# EAGLE design synthbadge (EAGLE 9.7.0)
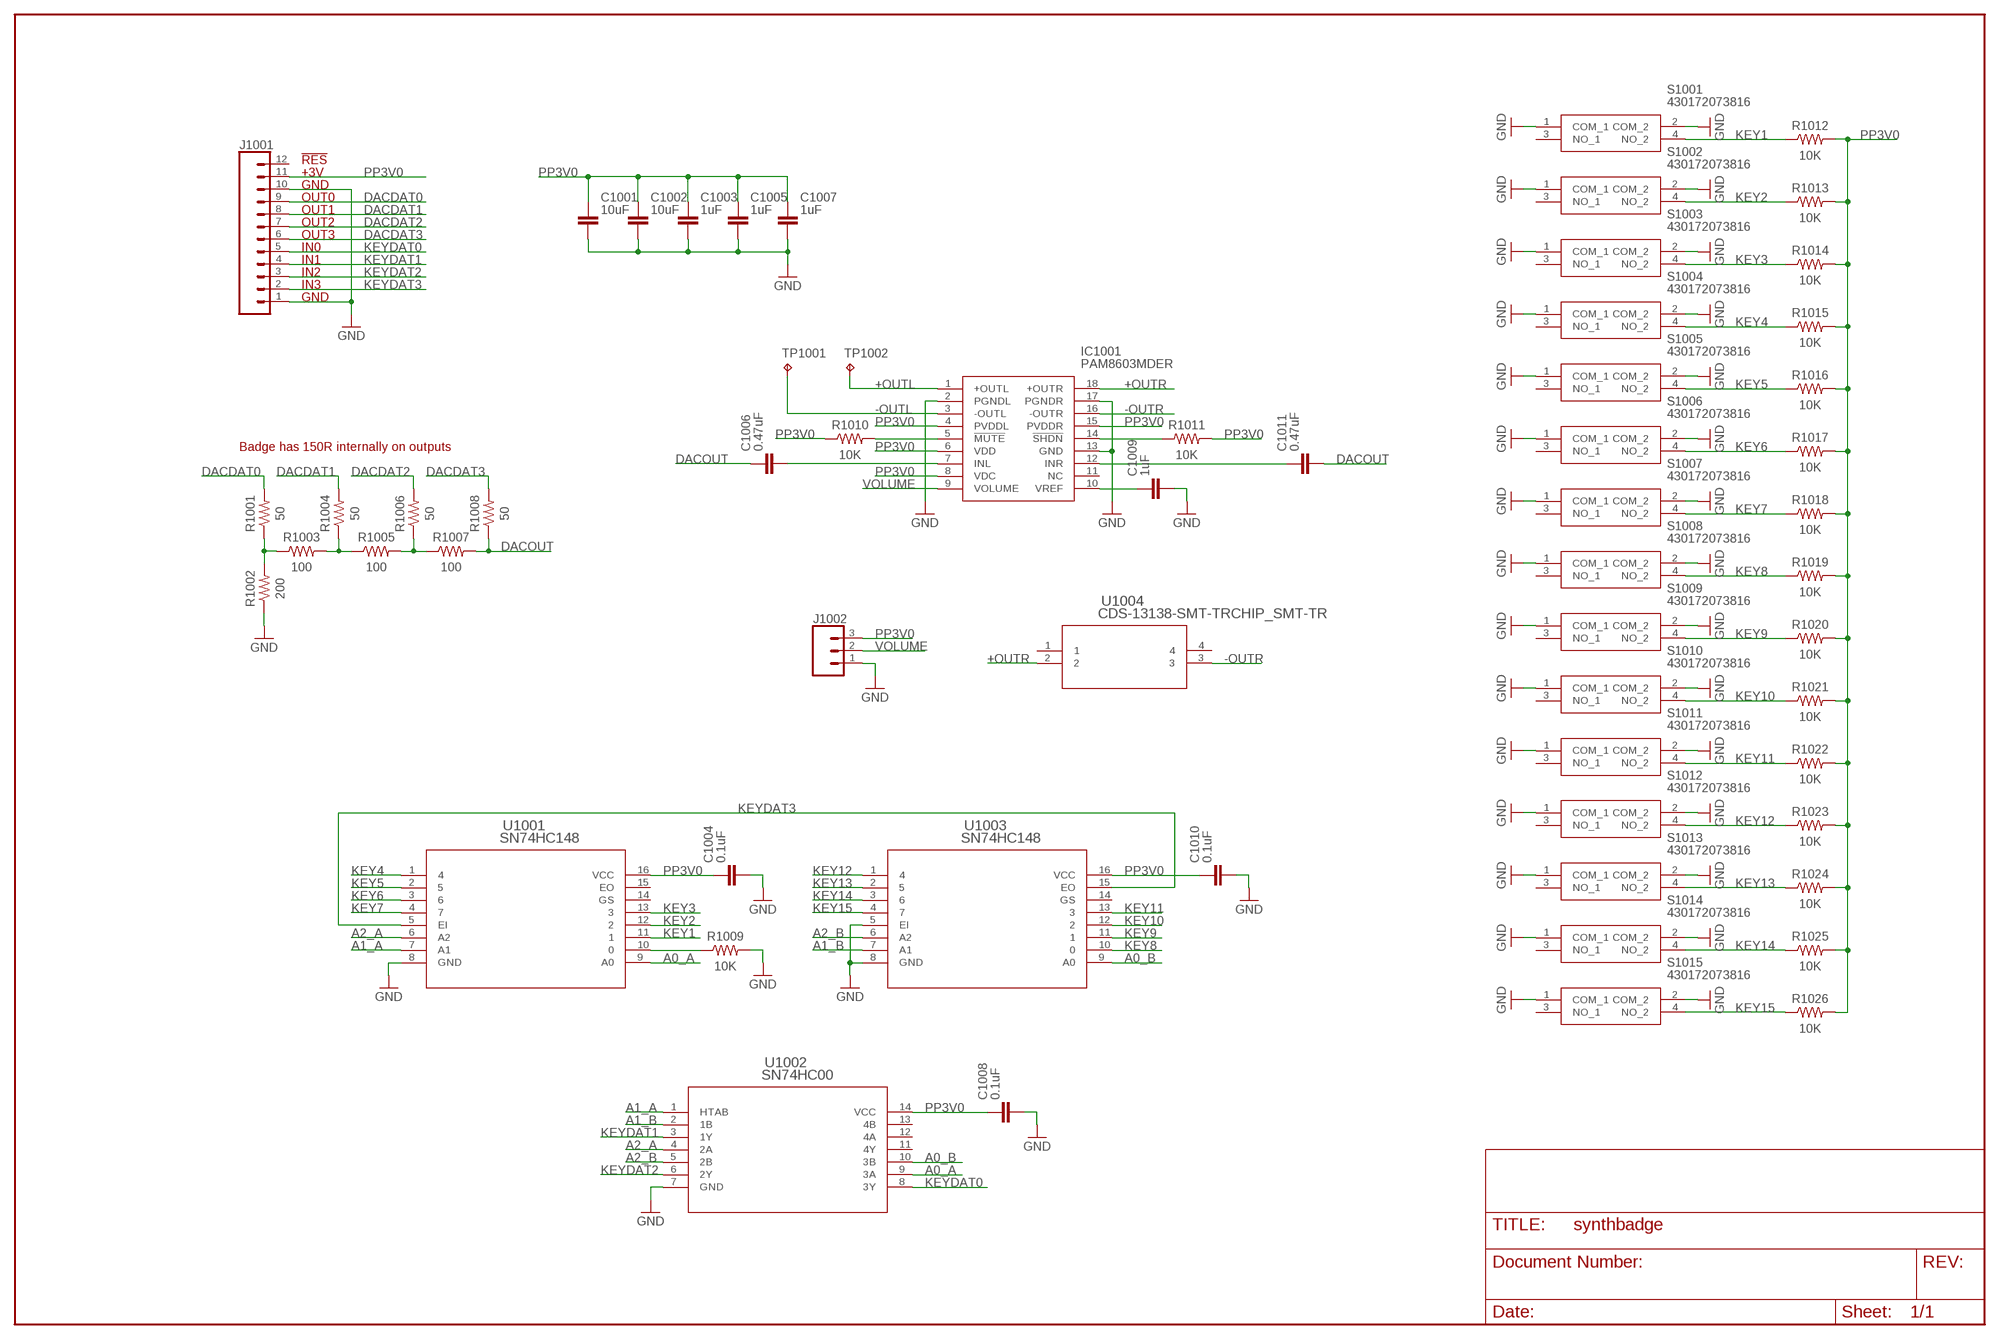
[diagram p0: schematic, sheet 1]

## Parts
C1001  10uF  C_CHIP-0805(2012-METRIC)  [CAPC2012X110]
C1002  10uF  C_CHIP-0805(2012-METRIC)  [CAPC2012X110]
C1003  1uF  C_CHIP-0805(2012-METRIC)  [CAPC2012X110]
C1004  0.1uF  C_CHIP-0805(2012-METRIC)  [CAPC2012X110]
C1005  1uF  C_CHIP-0805(2012-METRIC)  [CAPC2012X110]
C1006  0.47uF  C_CHIP-0805(2012-METRIC)  [CAPC2012X110]
C1007  1uF  C_CHIP-0805(2012-METRIC)  [CAPC2012X110]
C1008  0.1uF  C_CHIP-0805(2012-METRIC)  [CAPC2012X110]
C1009  1uF  C_CHIP-0805(2012-METRIC)  [CAPC2012X110]
C1010  0.1uF  C_CHIP-0805(2012-METRIC)  [CAPC2012X110]
C1011  0.47uF  C_CHIP-0805(2012-METRIC)  [CAPC2012X110]
IC1001  PAM8603MDER  [SOIC127P1032X270-18N]
J1001  CONN_12  [1X12]
J1002  CONN_03  [1X03]
R1001  50  R-US_CHIP-0805(2012-METRIC)  [RESC2012X65]
R1002  200  R-US_CHIP-0805(2012-METRIC)  [RESC2012X65]
R1003  100  R-US_CHIP-0805(2012-METRIC)  [RESC2012X65]
R1004  50  R-US_CHIP-0805(2012-METRIC)  [RESC2012X65]
R1005  100  R-US_CHIP-0805(2012-METRIC)  [RESC2012X65]
R1006  50  R-US_CHIP-0805(2012-METRIC)  [RESC2012X65]
R1007  100  R-US_CHIP-0805(2012-METRIC)  [RESC2012X65]
R1008  50  R-US_CHIP-0805(2012-METRIC)  [RESC2012X65]
R1009  10K  R-US_CHIP-0805(2012-METRIC)  [RESC2012X65]
R1010  10K  R-US_CHIP-0805(2012-METRIC)  [RESC2012X65]
R1011  10K  R-US_CHIP-0805(2012-METRIC)  [RESC2012X65]
R1012  10K  R-US_CHIP-0805(2012-METRIC)  [RESC2012X65]
R1013  10K  R-US_CHIP-0805(2012-METRIC)  [RESC2012X65]
R1014  10K  R-US_CHIP-0805(2012-METRIC)  [RESC2012X65]
R1015  10K  R-US_CHIP-0805(2012-METRIC)  [RESC2012X65]
R1016  10K  R-US_CHIP-0805(2012-METRIC)  [RESC2012X65]
R1017  10K  R-US_CHIP-0805(2012-METRIC)  [RESC2012X65]
R1018  10K  R-US_CHIP-0805(2012-METRIC)  [RESC2012X65]
R1019  10K  R-US_CHIP-0805(2012-METRIC)  [RESC2012X65]
R1020  10K  R-US_CHIP-0805(2012-METRIC)  [RESC2012X65]
R1021  10K  R-US_CHIP-0805(2012-METRIC)  [RESC2012X65]
R1022  10K  R-US_CHIP-0805(2012-METRIC)  [RESC2012X65]
R1023  10K  R-US_CHIP-0805(2012-METRIC)  [RESC2012X65]
R1024  10K  R-US_CHIP-0805(2012-METRIC)  [RESC2012X65]
R1025  10K  R-US_CHIP-0805(2012-METRIC)  [RESC2012X65]
R1026  10K  R-US_CHIP-0805(2012-METRIC)  [RESC2012X65]
S1001  430172073816  [430172073816]
S1002  430172073816  [430172073816]
S1003  430172073816  [430172073816]
S1004  430172073816  [430172073816]
S1005  430172073816  [430172073816]
S1006  430172073816  [430172073816]
S1007  430172073816  [430172073816]
S1008  430172073816  [430172073816]
S1009  430172073816  [430172073816]
S1010  430172073816  [430172073816]
S1011  430172073816  [430172073816]
S1012  430172073816  [430172073816]
S1013  430172073816  [430172073816]
S1014  430172073816  [430172073816]
S1015  430172073816  [430172073816]
TP1001  TPB2,54  [B2,54]
TP1002  TPB2,54  [B2,54]
U1001  SN74HC148  SN74HC148_D_16D16_TEX  [D16_TEX]
U1002  SN74HC00  SN74HC00_D_14D14_TEX  [D14_TEX]
U1003  SN74HC148  SN74HC148_D_16D16_TEX  [D16_TEX]
U1004  CDS-13138-SMT-TRCHIP_SMT-TR  [CHIP_SMT-TR]

## Nets
+OUTL: IC1001.1(+OUTL) TP1002.TP
+OUTR: IC1001.18(+OUTR) U1004.2
-OUTL: IC1001.3(-OUTL) TP1001.TP
-OUTR: IC1001.16(-OUTR) U1004.3
A0_A: U1001.9(A0) U1002.9(3A)
A0_B: U1002.10(3B) U1003.9(A0)
A1_A: U1001.7(A1) U1002.1(HTAB)
A1_B: U1002.2(1B) U1003.7(A1)
A2_A: U1001.6(A2) U1002.4(2A)
A2_B: U1002.5(2B) U1003.6(A2)
DACDAT0: J1001.9 R1001.2
DACDAT1: J1001.8 R1004.2
DACDAT2: J1001.7 R1006.2
DACDAT3: J1001.6 R1008.2
DACOUT: C1006.1 C1011.2 R1007.2 R1008.1
GND: C1001.2 C1002.2 C1003.2 C1004.2 C1005.2 C1007.2 C1008.2 C1009.2 C1010.2 IC1001.2(PGNDL) IC1001.13(GND) IC1001.17(PGNDR) J1001.1 J1001.10 J1002.1 R1002.1 R1009.2 S1001.1(COM_1) S1001.2(COM_2) S1002.1(COM_1) S1002.2(COM_2) S1003.1(COM_1) S1003.2(COM_2) S1004.1(COM_1) S1004.2(COM_2) S1005.1(COM_1) S1005.2(COM_2) S1006.1(COM_1) S1006.2(COM_2) S1007.1(COM_1) S1007.2(COM_2) S1008.1(COM_1) S1008.2(COM_2) S1009.1(COM_1) S1009.2(COM_2) S1010.1(COM_1) S1010.2(COM_2) S1011.1(COM_1) S1011.2(COM_2) S1012.1(COM_1) S1012.2(COM_2) S1013.1(COM_1) S1013.2(COM_2) S1014.1(COM_1) S1014.2(COM_2) S1015.1(COM_1) S1015.2(COM_2) U1001.8(GND) U1002.7(GND) U1003.5(EI) U1003.8(GND)
KEY1: R1012.1 S1001.4(NO_2) U1001.11
KEY2: R1013.1 S1002.4(NO_2) U1001.12
KEY3: R1014.1 S1003.4(NO_2) U1001.13
KEY4: R1015.1 S1004.4(NO_2) U1001.1
KEY5: R1016.1 S1005.4(NO_2) U1001.2
KEY6: R1017.1 S1006.4(NO_2) U1001.3
KEY7: R1018.1 S1007.4(NO_2) U1001.4
KEY8: R1019.1 S1008.4(NO_2) U1003.10
KEY9: R1020.1 S1009.4(NO_2) U1003.11
KEY10: R1021.1 S1010.4(NO_2) U1003.12
KEY11: R1022.1 S1011.4(NO_2) U1003.13
KEY12: R1023.1 S1012.4(NO_2) U1003.1
KEY13: R1024.1 S1013.4(NO_2) U1003.2
KEY14: R1025.1 S1014.4(NO_2) U1003.3
KEY15: R1026.1 S1015.4(NO_2) U1003.4
KEYDAT0: J1001.5 U1002.8(3Y)
KEYDAT1: J1001.4 U1002.3(1Y)
KEYDAT2: J1001.3 U1002.6(2Y)
KEYDAT3: J1001.2 U1001.5(EI) U1003.15(EO)
N$1: C1006.2 IC1001.7(INL)
N$2: C1011.1 IC1001.12(INR)
N$3: C1009.1 IC1001.10(VREF)
N$4: R1009.1 U1001.10
N$5: IC1001.14(!SHDN) R1011.1
N$6: IC1001.5(!MUTE) R1010.2
N$11: R1001.1 R1002.2 R1003.1
N$12: R1003.2 R1004.1 R1005.1
N$13: R1005.2 R1006.1 R1007.1
PP3V0: C1001.1 C1002.1 C1003.1 C1004.1 C1005.1 C1007.1 C1008.1 C1010.1 IC1001.4(PVDDL) IC1001.6(VDD) IC1001.8(VDC) IC1001.15(PVDDR) J1001.11 J1002.3 R1010.1 R1011.2 R1012.2 R1013.2 R1014.2 R1015.2 R1016.2 R1017.2 R1018.2 R1019.2 R1020.2 R1021.2 R1022.2 R1023.2 R1024.2 R1025.2 R1026.2 U1001.16(VCC) U1002.14(VCC) U1003.16(VCC)
VOLUME: IC1001.9(VOLUME) J1002.2
Unconnected: IC1001.11(NC) J1001.12 S1001.3(NO_1) S1002.3(NO_1) S1003.3(NO_1) S1004.3(NO_1) S1005.3(NO_1) S1006.3(NO_1) S1007.3(NO_1) S1008.3(NO_1) S1009.3(NO_1) S1010.3(NO_1) S1011.3(NO_1) S1012.3(NO_1) S1013.3(NO_1) S1014.3(NO_1) S1015.3(NO_1) U1001.14(GS) U1001.15(EO) U1002.11(4Y) U1002.12(4A) U1002.13(4B) U1003.14(GS) U1004.1 U1004.4

## Notes on the sheet
- !RES
- +3V
- GND
- OUT0
- OUT1
- OUT2
- OUT3
- IN0
- IN1
- IN2
- IN3
- GND
- Badge has 150R internally on outputs

## Library data of the parts
C1001-C1011 = rc_WAi:C: Capacitor - Generic; CATEGORY: Capacitor
IC1001 = PAM8603MDER:PAM8603MDER: Audio Amplifiers 3W STEREO FILTERLESS CLASS-D AUDIO AMP Source: Datasheet <https://datasheet.datasheetarchive.com/originals/distributors/Datasheets-DGA6/534093.pdf>; DESCRIPTION: Audio Amplifiers 3W STEREO FILTERLESS CLASS-D AUDIO AMP; HEIGHT: 2.7mm; MANUFACTURER_NAME: Diodes Inc.; MANUFACTURER_PART_NUMBER: PAM8603MDER; MOUSER_PART_NUMBER: 621-PAM8603MDER; MOUSER_PRICE-STOCK: https://www.mouser.co.uk/ProductDetail/Diodes-Incorporated/PAM8603MDER?qs=pYVYkI7xuRXr2t7zO2c6JA%3D%3D
J1001 = SparkFun-Connectors:CONN_12: Multi connection point. Often used as Generic Header-pin footprint for 0.1 inch spaced/style header connections On any of the 0.1 inch spaced packages, you can populate with these: Break Away Headers - Straight <https://www.sparkfun.com/products/116> (PRT-00116) Break Away Male Headers - Right Angle <https://www.sparkfun.com/products/553> (PRT-00553) Female Headers <https://www.sparkfun.com/products/115> (PRT-00115) Break Away Headers - Machine Pin <https://www.sparkfun.com/products/117> (PRT-00117) Break Away Female Headers - Swiss Machine Pin <https://www.sparkfun.com/products/743> (PRT-00743) For SCREWTERMINALS and SPRING TERMINALS visit here: Screw Terimnals on SparkFun.com <https://www.sparkfun.com/search/results?term=Screw+Terminals> (5mm/3.5mm/2.54mm spacing) This device is also useful as a general connection point to wire up your design to another part of your project. Our various solder wires solder well into these plated through hole pads. Hook-Up Wire - Assortment (Stranded, 22 AWG) <https://www.sparkfun.com/products/11375> (PRT-11375) Hook-Up Wire - Assortment (Solid Core, 22 AWG) <https://www.sparkfun.com/products/11367> (PRT-11367) View the entire wire category on our website here <https://www.sparkfun.com/categories/141> Special notes: Molex polarized connector foot print use with SKU : PRT-08231 with associated crimp pins and housings. 1MM SMD Version SKU: PRT-10208 NOTES ON THE VARIANTS LOCK and LOCK_LONGPADS... This footprint was designed to help hold the alignment of a through-hole component (i.e. 6-pin header) while soldering it into place. You may notice that each hole has been shifted either up or down by 0.005 of an inch from it's more standard position (which is a perfectly straight line). This slight alteration caused the pins (the squares in the middle) to touch the edges of the holes. Because they are alternating, it causes a "brace" to hold the component in place. 0.005 has proven to be the perfect amount of "off-center" position when using our standard breakaway headers. Although looks a little odd when you look at the bare footprint, once you have a header in there, the alteration is very hard to notice. Also,if you push a header all the way into place, it is covered up entirely on the bottom side.
J1002 = SparkFun-Connectors:CONN_03: Multi connection point. Often used as Generic Header-pin footprint for 0.1 inch spaced/style header connections On any of the 0.1 inch spaced packages, you can populate with these: Break Away Headers - Straight <https://www.sparkfun.com/products/116> (PRT-00116) Break Away Male Headers - Right Angle <https://www.sparkfun.com/products/553> (PRT-00553) Female Headers <https://www.sparkfun.com/products/115> (PRT-00115) Break Away Headers - Machine Pin <https://www.sparkfun.com/products/117> (PRT-00117) Break Away Female Headers - Swiss Machine Pin <https://www.sparkfun.com/products/743> (PRT-00743) Stackable Header - 3 Pin (Female, 0.1") <https://www.sparkfun.com/products/13875> (PRT-13875) For SCREWTERMINALS and SPRING TERMINALS visit here: Screw Terimnals on SparkFun.com <https://www.sparkfun.com/search/results?term=Screw+Terminals> (5mm/3.5mm/2.54mm spacing) This device is also useful as a general connection point to wire up your design to another part of your project. Our various solder wires solder well into these plated through hole pads. Hook-Up Wire - Assortment (Stranded, 22 AWG) <https://www.sparkfun.com/products/11375> (PRT-11375) Hook-Up Wire - Assortment (Solid Core, 22 AWG) <https://www.sparkfun.com/products/11367> (PRT-11367) View the entire wire category on our website here <https://www.sparkfun.com/categories/141> Special notes: Molex polarized connector foot print use with SKU : PRT-08232 with associated crimp pins and housings.
R1001-R1026 = rc_WAi:R-US: Resistor Fixed - ANSI; CATEGORY: Resistor; SUB-CATEGORY: Fixed
S1001-S1015 = 430172073816:430172073816: WS-TASV Tact Switch, SMD Version Source: Datasheet <http://katalog.we-online.de/em/datasheet/430162073826.pdf>; DESCRIPTION: WS-TASV Tact Switch, SMD Version; HEIGHT: 7mm; MANUFACTURER_NAME: Wurth Elektronik; MANUFACTURER_PART_NUMBER: 430172073816; MOUSER_PART_NUMBER: 710-430172073816; MOUSER_PRICE-STOCK: https://www.mouser.co.uk/ProductDetail/Wurth-Elektronik/430172073816?qs=sPbYRqrBIVlwPnFUfMKAug%3D%3D
TP1001 TP1002 = testpad:TP: Test pad
U1001 U1003 = synthbadge:SN74HC148_D_16; COPYRIGHT: Copyright (C) 2022 Ultra Librarian. All rights reserved.; MANUFACTURER_PART_NUMBER: SN74HC148_D_16; MFR_NAME: Texas Instruments
U1002 = synthbadge:SN74HC00_D_14; COPYRIGHT: Copyright (C) 2022 Ultra Librarian. All rights reserved.; MANUFACTURER_PART_NUMBER: SN74HC00_D_14; MFR_NAME: Texas Instruments
U1004 = synthbadge:CDS-13138-SMT-TR; COPYRIGHT: Copyright (C) 2022 Ultra Librarian. All rights reserved.; MANUFACTURER_PART_NUMBER: CDS-13138-SMT-TR; MFR_NAME: CUI Inc

## Board
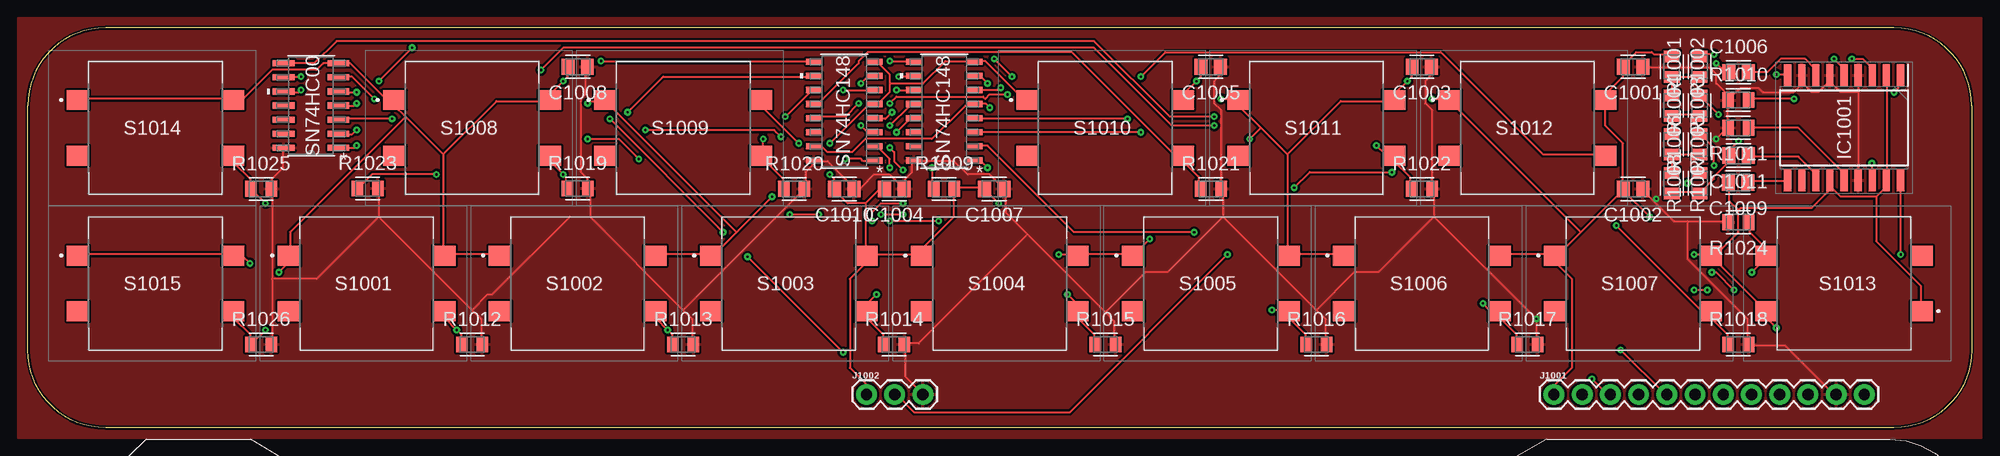
[diagram p1: board, top side]
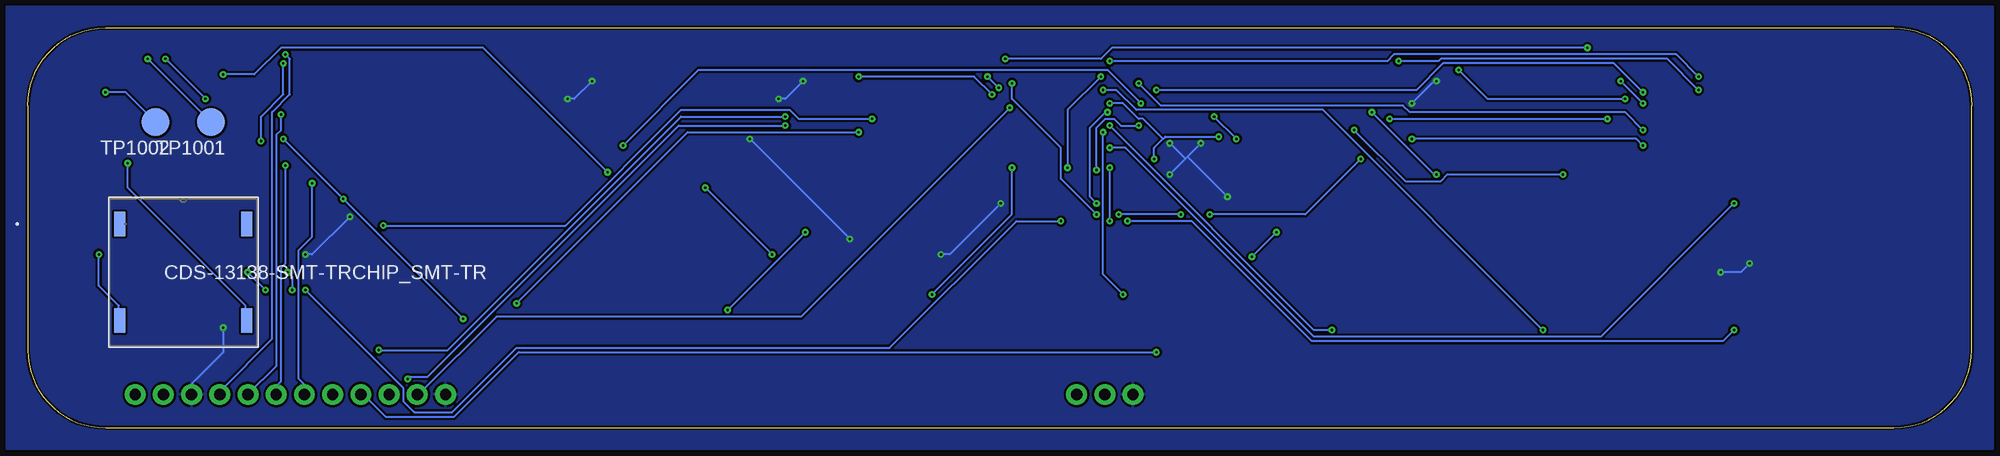
[diagram p2: board, bottom side, seen from below]

Size 175 x 36 mm. Coordinates in mm from the lower left corner, seen from the top.
Outline: 175,29 175,7 arc-90 168,0 7,0 arc-90 0,7 0,29 arc-90 7,36 168,36 arc-90 175,29
Copper layers (1*16): Top 0.035mm / dielectric 1.5mm / Bottom 0.035mm
Design rules "pv-pth-mid4-1.6mm *": minimum track width 0.2mm, minimum drill 0.2mm, track to track 0.2mm, track to pad 0.2mm, pad to pad 0.2mm, via to via 0.2mm, smd to smd 0mil, copper to edge 0.2mm, drill to drill 0.2mm, minimum pad ring 0.2mm, minimum via ring 0.2mm, stop-mask expansion 0mil, vias tented up to drill 100mm, thermal gap 0.2mm

### Footprints (pad centres in the part's own frame; a part is rotated, then mirrored left to right if it is on the bottom)
CAPC2012X110 = smd 1.165 x 1.465: 1 -0.875,0; 2 0.875,0
SOIC127P1032X270-18N = smd 1.95 x 0.65: 1 -4.725,5.08; 2 -4.725,3.81; 3 -4.725,2.54; 4 -4.725,1.27; 5 -4.725,0; 6 -4.725,-1.27; 7 -4.725,-2.54; 8 -4.725,-3.81; 9 -4.725,-5.08; 10 4.725,-5.08; 11 4.725,-3.81; 12 4.725,-2.54; 13 4.725,-1.27; 14 4.725,0; 15 4.725,1.27; 16 4.725,2.54; 17 4.725,3.81; 18 4.725,5.08
1X12 = drill 1.016 pad 1.88: 1 0,0; 2 2.54,0; 3 5.08,0; 4 7.62,0; 5 10.16,0; 6 12.7,0; 7 15.24,0; 8 17.78,0; 9 20.32,0; 10 22.86,0; 11 25.4,0; 12 27.94,0
1X03 = drill 1.016 pad 1.88: 1 0,0; 2 2.54,0; 3 5.08,0
RESC2012X65 = smd 1.031 x 1.42: 1 -0.919,0; 2 0.919,0
430172073816 = smd 2 x 1.8: 1 -7,2.5; 2 7,2.5; 3 -7,-2.5; 4 7,-2.5
B2,54 = smd 2.54 x 2.54: TP 0,0
D16_TEX = smd 1.455 x 0.558: 1 -2.721,4.445; 2 -2.721,3.175; 3 -2.721,1.905; 4 -2.721,0.635; 5 -2.721,-0.635; 6 -2.721,-1.905; 7 -2.721,-3.175; 8 -2.721,-4.445; 9 2.721,-4.445; 10 2.721,-3.175; 11 2.721,-1.905; 12 2.721,-0.635; 13 2.721,0.635; 14 2.721,1.905; 15 2.721,3.175; 16 2.721,4.445
D14_TEX = smd 1.97 x 0.558: 1 -2.464,3.81; 2 -2.464,2.54; 3 -2.464,1.27; 4 -2.464,0; 5 -2.464,-1.27; 6 -2.464,-2.54; 7 -2.464,-3.81; 8 2.464,-3.81; 9 2.464,-2.54; 10 2.464,-1.27; 11 2.464,0; 12 2.464,1.27; 13 2.464,2.54; 14 2.464,3.81
CHIP_SMT-TR = smd 0.991 x 2.21: 1 -5.702,4.35; 2 -5.702,-4.35; 3 5.702,-4.35; 4 5.702,4.35

### Placement (x,y rotation side)
C1001  144.5,32.5 180 top
C1002  144.5,21.5 180 top
C1003  125.5,32.5 180 top
C1004  78,21.5 180 top
C1005  106.5,32.5 180 top
C1006  154,32 0 top
C1007  87,21.5 180 top
C1008  49.5,32.5 180 top
C1009  153.96,22.08 180 top
C1010  73.5,21.5 180 top
C1011  154,24.5 180 top
IC1001  163.5,27 270 top
J1001  137.39,3 0 top
J1002  75.5,3 0 top
R1001  150.5,32.5 90 top
R1002  148,32.5 270 top
R1003  148,29 270 top
R1004  150.5,29 90 top
R1005  148,25.5 270 top
R1006  150.5,25.5 90 top
R1007  148,22 270 top
R1008  150.5,22 90 top
R1009  82.5,21.5 0 top
R1010  154,29.5 0 top
R1011  154,27 180 top
R1012  40,7.5 0 top
R1013  59,7.5 0 top
R1014  78,7.5 0 top
R1015  97,7.5 0 top
R1016  116,7.5 0 top
R1017  135,7.5 0 top
R1018  154,7.5 0 top
R1019  49.49,21.54 0 top
R1020  69,21.5 0 top
R1021  106.5,21.5 0 top
R1022  125.5,21.5 0 top
R1023  30.59,21.54 0 top
R1024  154,18.5 180 top
R1025  21,21.5 0 top
R1026  21,7.5 0 top
S1001  30.5,13 0 top
S1002  49.5,13 0 top
S1003  68.5,13 0 top
S1004  87.5,13 0 top
S1005  106.5,13 0 top
S1006  125.5,13 0 top
S1007  144.5,13 0 top
S1008  40,27 0 top
S1009  59,27 0 top
S1010  97,27 0 top
S1011  116,27 0 top
S1012  135,27 0 top
S1013  163.5,13 180 top
S1014  11.5,27 0 top
S1015  11.5,13 0 top
TP1001  158.5,27.5 180 bottom
TP1002  163.5,27.5 180 bottom
U1001  82.5,28.5 180 top
U1002  25.5,29 180 top
U1003  73.5,28.5 180 top
U1004  161,14 0 bottom

### Tracks (layer width: path | path; a pad name or v marks a point on that pad's centre or on a via)
+OUTL  (via drill 0.2)
  Top 0.2: v168,30.2 168.4,30.6 168.4,31.6 IC1001.1
  Bottom 0.2: v168,30.2 166.2,30.2 TP1002.TP
+OUTR  (via drill 0.2)
  Top 0.2: v168.6,15.6 168.6,22.2 IC1001.18
  Bottom 0.2: v168.6,15.6 168.6,12.8 166.8,11 166.8,9.8 U1004.2
-OUTL  (via drill 0.2)
  Top 0.2: v164.2,33.2 165.2,33.2 166,32.4 166,31.8 IC1001.3
  Bottom 0.2: TP1001.TP v164.2,33.2
-OUTR  (via drill 0.2)
  Top 0.2: v166,23.8 166,22.4 IC1001.16
  Bottom 0.2: v166,23.8 166,21.6 155.4,11 155.4,9.8 U1004.3
A0_A  (via drill 0.2)
  Top 0.2: v77.6,33 79.6,33 U1001.9 | v24.6,31.6 23.2,31.6 U1002.9
  Bottom 0.2: v77.6,33 52.6,33 52,33.6 26.6,33.6 v24.6,31.6
A0_B  (via drill 0.2)
  Top 0.2: v51.6,33 70.6,33 U1003.9 | v24.6,30.4 24.4,30.2 23.2,30.2 U1002.10
  Bottom 0.2: v51.6,33 48,33 47.8,33.2 27.4,33.2 v24.6,30.4
A1_A  (via drill 0.2)
  Top 0.2: v86.4,31 85.8,31.6 85.4,31.6 U1001.7 | v76.8,19.2 v78.8,19.2 | v68.6,19.2 v71.2,19.2 | v55,24.2 53.2,26 v50.4,26 | v29.6,25.4 29.4,25.2 28,25.2 U1002.1
  Bottom 0.2: v86.4,31 86.4,29.6 82,25.2 82,22.4 v78.8,19.2 | v71.2,19.2 v76.8,19.2 | v68.6,19.2 60,19.2 v55,24.2 | v50.4,26 30.2,26 v29.6,25.4
A1_B  (via drill 0.2)
  Top 0.2: v75,31 75.6,31.6 76.2,31.6 U1003.7 | v29.6,26.8 29.2,26.4 28,26.4 U1002.2
  Bottom 0.2: v75,31 73,29 51.2,29 50.6,28.4 31.2,28.4 v29.6,26.8
A2_A  (via drill 0.2)
  Top 0.2: v87.6,30.6 87.4,30.4 85.4,30.4 U1001.6 | v87,33.2 v88.6,31.6 | v31.6,31.2 v34.6,34.2 | v29.6,29.2 29.4,29 U1002.4
  Bottom 0.2: v88.6,31.6 v87.6,30.6 | v87,33.2 78.4,33.2 77.4,34.2 v34.6,34.2 | v29.6,29.2 v31.6,31.2
A2_B  (via drill 0.2)
  Top 0.2: v73.4,30.4 76.2,30.4 U1003.6 | v29.6,30.2 28,30.2 U1002.5
  Bottom 0.2: v73.4,30.4 50,30.4 47.6,32.8 32.2,32.8 v29.6,30.2
DACDAT0  (via drill 0.2)
  Top 0.2: v151.8,33.6 150.6,33.6 R1001.2
  Bottom 0.2: v151.8,33.6 151.4,33.2 151.4,30 153,28.4 153,8 157.6,3.4 157.6,3 J1001.9
DACDAT1  (via drill 0.2)
  Top 0.2: v152.2,28.2 150.6,29.8 R1004.2
  Bottom 0.2: v152.2,28.2 152.2,26.8 152.6,26.4 152.6,5.6 155.2,3 J1001.8
DACDAT2  (via drill 0.2)
  Top 0.2: v151.8,23.6 151.8,25.2 150.6,26.4 R1006.2
  Bottom 0.2: v151.8,23.6 151.8,14.8 152.2,14.4 152.2,4.2 152.6,3.8 152.6,3 J1001.7
DACDAT3  (via drill 0.2)
  Top 0.2: v149.4,22 150.2,22.8 150.4,22.8 R1008.2
  Bottom 0.2: v149.4,22 149.4,17.2 150.6,16 150.6,4.4 150.2,4 150.2,3 J1001.6
DACOUT  (via drill 0.2)
  Top 0.2: R1007.2 148,21.2 150.4,21.2 R1008.1 150.6,21.2 151.8,22.4 151.8,22.6 153,23.8 153,24.4 C1011.2 153.2,24.6 153.2,25 v154,25.8 | v152,32.8 152.4,32.4 152.6,32.4 153,32 C1006.1
  Bottom 0.2: v152,32.8 152,30 154,28 v154,25.8
GND  (via drill 0.2)
  Top 0.2: 162.4,21.6 162.4,22.2 IC1001.13 162.4,21.6 | 162.4,21.6 163.2,20.8 166.4,20.8 | 166.4,20.8 167.2,21.6 167.2,22.2 IC1001.17 167.4,22.4 167.4,31.6 IC1001.2 | 166.4,20.8 166.4,16.8 170.4,12.8 170.4,10.6 S1013.1 | 154,19.6 153.2,20.4 153.2,22 C1009.2 | 154,19.6 154,17.6 152,15.6 151.6,15.6 S1007.2 | S1007.2 S1013.2 156.6,10.4 156.6,9.8 v157.4,9 | 162.4,21.6 160.6,19.8 154.2,19.8 154,19.6 | C1003.2 124.6,32.4 124.6,31.6 v124.2,31.2 123,30 S1011.2 123,29.4 118.2,29.4 113.4,24.6 | v126.4,29.6 128,29.6 S1012.1 128,29.4 139.8,17.6 | S1006.1 118.4,15.6 113.6,15.6 S1005.2 113.4,15.6 113.4,24.6 | S1010.2 104,30 v105.2,31.2 105.6,31.6 105.6,32.4 C1005.2 | v107.4,29.6 109,29.6 S1011.1 109,29 111,27 | 111,27 113.4,24.6 | R1002.1 148,33.6 146.4,33.6 146.2,33.8 144.8,33.8 143.6,32.6 C1001.2 143.6,32.4 143.6,31.6 142,30 S1012.2 142,27.2 143.6,25.6 143.6,21.6 C1002.2 143.6,21.4 | 137.6,15.4 139.8,17.6 | 139.8,17.6 143.6,21.4 | S1006.2 132.6,15.6 137.4,15.6 S1007.1 137.6,15.4 | 137.6,15.4 137.6,14.8 139,13.4 139,5.4 137.4,3.8 J1001.1 | v150,15.6 151.4,15.6 S1007.2 | 143.6,21.4 v146,19 | S1015.1 4.6,15.6 18.4,15.6 S1015.2 18.6,15.4 19.4,15.4 v20,14.8 | v22.6,14 23.4,14.8 23.4,15.4 S1001.1 23.6,15.6 23.6,17.6 34,28 | S1014.1 4.6,29.6 18.4,29.6 S1014.2 18.6,29.6 19.4,29.6 22,32.2 26,32.2 26.6,32.8 27.8,32.8 U1002.7 28,32.8 29,32.8 32.2,29.6 33,29.6 S1008.1 33,29 34,28 | C1008.2 48.6,32.4 48.6,31.6 v48.2,31.2 47,30 S1008.2 47,29.4 42.2,29.4 37.4,24.6 | 52,29.4 50.6,29.4 v50.4,29.2 | S1002.1 42.4,15.6 37.6,15.6 S1001.2 37.4,15.6 37.4,24.6 | 34,28 37.4,24.6 | S1010.1 90,29.6 89.6,29.6 86.2,33 85.4,33 U1001.8 85.2,33 82.6,33 80.6,31 77.6,31
  Top 0.2: S1002.2 56.6,15.6 61.4,15.6 S1003.1 62.2,16.2 62.4,16.2 63.8,17.6 | 77.6,31 77.6,31.8 76.4,33 U1003.8 | 77.6,31 77.6,30.2 76.6,29.2 76.4,29.2 U1003.5 76.2,29 75.6,29 v72.2,25.6 | 75.4,20.2 73.8,20.2 72.8,21.2 72.8,21.4 C1010.2 72.6,21.6 72.6,22.4 v72.2,22.8 | 75.4,20.2 76.6,21.4 77,21.4 C1004.2 | 75.4,20.2 75.4,15.6 S1003.2 | S1009.2 66,29 v69.4,25.6 | S1003.2 75.6,15.6 80.4,15.6 S1004.1 80.6,15.6 80.6,16.2 83.4,19 83.4,21.4 R1009.2 83.6,21.6 86,21.6 C1007.2 86.2,21.4 v87.4,20.2 | v67,20.8 63.8,17.6 | v92.8,15.6 94.4,15.6 S1004.2 94.6,15.6 99.4,15.6 S1005.1 v101,17 | J1002.1 75.4,3 75.4,4 74,5.4 74,13.4 75.4,14.8 75.4,15.4 S1003.2 | 63.8,17.6 52,29.4 | 52,29.4 S1009.1 | v110,26 111,27
  Bottom 0.2: v157.4,9 157.4,6.8 160.2,4 160.2,3 J1001.10 | v126.4,29.6 125.8,29.6 v124.2,31.2 | v107.4,29.6 106.8,29.6 v105.2,31.2 | v150,15.6 149.4,15.6 v146,19 | v22.6,14 20.8,14 v20,14.8 | v50.4,29.2 48.4,31.2 v48.2,31.2 | v72.2,22.8 70.8,24.2 | 70.8,24.2 70.6,24.4 | 70.6,24.4 v69.4,25.6 | 70.8,24.2 v72.2,25.6 | 70.6,24.4 v67,20.8 | v92.8,15.6 92,15.6 v87.4,20.2 | v101,17 v110,26
  pour Bottom: -1.92,-1.92 176.92,-1.92 176.92,37.92 -1.92,37.92
KEY1  (via drill 0.2)
  Top 0.2: R1012.1 39,7.6 39,8.4 v38.6,8.8 37.6,9.8 37.6,10.4 S1001.4 | v78.2,30.4 79.6,30.4 U1001.11
  Bottom 0.2: v78.2,30.4 77,30.4 75.2,28.6 58.4,28.6 v38.6,8.8
KEY2  (via drill 0.2)
  Top 0.2: R1013.1 58,7.6 58,8.4 v57.6,8.8 56.6,9.8 56.6,10.4 S1002.4 | v77.6,27.2 79.4,29 79.6,29 U1001.12
  Bottom 0.2: v77.6,27.2 59.2,8.8 v57.6,8.8
KEY3  (via drill 0.2)
  Top 0.2: R1014.1 77,7.6 77,8.4 75.6,9.8 75.6,10.4 S1003.4 75.6,10.6 75.6,11.2 v76.4,12 | v78.2,26.6 79.4,27.8 79.6,27.8 U1001.13
  Bottom 0.2: v78.2,26.6 78.2,13.8 v76.4,12
KEY4  (via drill 0.2)
  Top 0.2: R1015.1 96,7.6 96,8.4 94.6,9.8 94.6,10.4 S1004.4 94.4,10.6 94.4,11.2 v93.6,12 | v86.4,23.4 85.8,24 85.4,24 U1001.1
  Bottom 0.2: v86.4,23.4 86.4,19.2 v93.6,12
KEY5  (via drill 0.2)
  Top 0.2: R1016.1 115,7.6 115,8.4 113.6,9.8 113.6,10.4 S1005.4 113.4,10.6 v112,10.6 | v105,17.6 94.2,17.6 86.4,25.4 85.4,25.4 U1001.2
  Bottom 0.2: v112,10.6 v105,17.6
KEY6  (via drill 0.2)
  Top 0.2: R1017.1 134,7.6 134,8.4 132.6,9.8 132.6,10.4 S1006.4 132.4,10.6 131.6,10.6 v131,11.2 | v100.2,26.6 85.4,26.6 U1001.3
  Bottom 0.2: v100.2,26.6 115.6,26.6 v131,11.2
KEY7  (via drill 0.2)
  Top 0.2: R1018.1 153,7.6 153,8.4 151.6,9.8 151.6,10.4 S1007.4 151.4,10.6 150.6,10.6 v143,18.2 | v99,27.8 85.4,27.8 U1001.4
  Bottom 0.2: v99,27.8 105.6,27.8 106.4,28.6 116.2,28.6 126.6,18.2 v143,18.2
KEY8  (via drill 0.2)
  Top 0.2: S1008.4 47,24 v48.2,22.8 48.4,22.6 48.4,21.6 R1019.1 | v54,28.4 57.2,31.6 70.6,31.6 U1003.10
  Bottom 0.2: v54,28.4 48.4,22.8 v48.2,22.8
KEY9  (via drill 0.2)
  Top 0.2: R1020.1 68,21.6 68,22.4 66,24.4 S1009.4 66,24.6 66.2,24.8 v66.2,26 | v68.2,28 70.6,30.4 U1003.11
  Bottom 0.2: v66.2,26 v68.2,28
KEY10
  Top 0.2: R1021.1 105.4,21.6 105.4,22.6 104,24 S1010.4 104,24.6 103.2,24.6 94,33.8 75.6,33.8 74.8,33 74.8,32.8 71.2,29.2 70.8,29.2 U1003.12
KEY11  (via drill 0.2)
  Top 0.2: R1022.1 124.4,21.6 124.4,22.6 123,24 S1011.4 123,24.6 122.2,24.6 v121.4,25.4 | v74.8,29.2 73.6,28 70.8,28 U1003.13
  Bottom 0.2: v74.8,29.2 77.8,32.2 114.6,32.2 v121.4,25.4
KEY12  (via drill 0.2)
  Top 0.2: v36.8,22.8 31,22.8 29.8,21.6 R1023.1 | v55.6,26.8 67.2,26.8 v67.8,26.2 | v73.6,24.2 75,24.2 75.2,24 76.2,24 U1003.1 | v100.2,31.6 102.4,33.8 127.2,33.8 136.4,24.6 142,24.6 S1012.4 | v88.2,30 86.6,30 86.2,29.6 86,29.8 78.2,29.8 v77.6,29.2
  Bottom 0.2: v36.8,22.8 47.2,22.8 47.8,22.2 51,22.2 v55.6,26.8 | v67.8,26.2 72.6,26.2 72.8,26 | 72.8,26 73.6,25.2 v73.6,24.2 | v100.2,31.6 89.8,31.6 v88.2,30 | v77.6,29.2 76.4,29.2 75,27.8 74.6,27.8 72.8,26
KEY13  (via drill 0.2)
  Top 0.2: R1024.1 155,18.4 155,17.6 156.4,16.2 156.4,15.6 S1013.4 156.6,15.4 v155.2,14 | v77.6,23.4 77.6,24.2 76.6,25.2 76.4,25.2 U1003.2 | v82,18.6 v77.6,18.6 | v151.2,12.4 v150,12.4 | v151.6,14 152,14 v153.6,12.4
  Bottom 0.2: v77.6,18.6 v77.6,23.4 | v82,18.6 86,18.6 97.4,7.2 131,7.2 136.8,1.4 140.2,1.4 141.2,2.4 141.2,3.6 v150,12.4 | v151.2,12.4 151.2,13.6 v151.6,14 | v155.2,14 v153.6,12.4
KEY14  (via drill 0.2)
  Top 0.2: S1014.4 18.6,24.4 18.6,23.8 20,22.4 20,21.6 R1025.1 20.2,21.4 v21.4,20.2 | v75,27.2 75.6,26.6 76.2,26.6 U1003.3 | v78.8,23.2 78,24 78,24.8 v77.6,25.2
  Bottom 0.2: v75,27.2 76.6,27.2 77.2,27.8 78,27.8 78.8,27 v78.8,23.2 | v77.6,25.2 76.2,25.2 59.2,8.2 33.4,8.2 v21.4,20.2
KEY15  (via drill 0.2)
  Top 0.2: S1015.4 18.6,10.4 18.6,9.8 20,8.4 20,7.6 R1026.1 20.2,7.6 v21.4,8.8 | v77.8,28.4 77.2,27.8 76.4,27.8 U1003.4 | v78.8,20.2 76.8,20.2 76,19.4 v76,18.6
  Bottom 0.2: v77.8,28.4 78,28.4 79.4,27 79.4,20.8 v78.8,20.2 | v76,18.6 70.2,18.6 59.4,7.8 22.4,7.8 v21.4,8.8
KEYDAT0  (via drill 0.2)
  Top 0.2: v106.8,28 102.8,28 96,34.8 27.8,34.8 25.8,32.8 23.2,32.8 U1002.8 | v143.4,7 147.4,3 J1001.5
  Bottom 0.2: v106.8,28 116.2,28 137.2,7 v143.4,7
KEYDAT1  (via drill 0.2)
  Top 0.2: v32.8,27.8 28,27.8 U1002.3 | v62.6,17.6 v52.4,27.8 | v73.4,6.8 v64.8,15.4
  Bottom 0.2: v52.4,27.8 v32.8,27.8 | v64.8,15.4 v62.6,17.6 | v73.4,6.8 130.8,6.8 136.6,1 142.8,1 144.8,3 J1001.4
KEYDAT2  (via drill 0.2)
  Top 0.2: v31.2,29.6 29.2,31.6 28,31.6 U1002.6 | v46.2,32.2 48.2,34.2 96,34.2 103,27.2 v106.8,27.2 | v140.8,4.4 142.2,3 J1001.3
  Bottom 0.2: v31.2,29.6 43.6,29.6 v46.2,32.2 | v106.8,27.2 116.4,27.2 139,4.6 140.6,4.6 v140.8,4.4
KEYDAT3  (via drill 0.2)
  Top 0.2: U1003.15 70.8,25.2 71.6,25.2 72,24.8 74.2,24.8 75.4,26 81.4,26 84.4,29 85.2,29 U1001.5 85.4,29.2 86.2,29.2 v86.6,28.8
  Bottom 0.2: v86.6,28.8 105.4,10 132.8,10 139.8,3 J1001.2
N$1
  Top 0.2: C1006.2 156.6,32 157.8,33.2 160,33.2 160.8,32.4 160.8,31.8 IC1001.7
N$2
  Top 0.2: C1011.1 155,24.4 159.4,24.4 160.8,23 160.8,22.4 IC1001.12
N$3
  Top 0.2: C1009.1 155,22.2 158.4,22.2 IC1001.10
N$4  (via drill 0.2)
  Top 0.2: v81.4,23.4 81.4,21.6 R1009.1 | v78.4,31.6 79.6,31.6 U1001.10
  Bottom 0.2: v81.4,23.4 81.4,28.6 v78.4,31.6
N$5
  Top 0.2: R1011.1 159.4,27 163.4,23 163.4,22.4 IC1001.14
N$6  (via drill 0.2)
  Top 0.2: v159,29.6 155,29.6 R1010.2 | v162.6,33.2 163.4,32.4 163.4,31.8 IC1001.5
  Bottom 0.2: v162.6,33.2 v159,29.6
N$11
  Top 0.2: R1003.1 R1002.2 148,31.6 150.4,31.6 R1001.1
N$12
  Top 0.2: R1005.1 R1003.2 148,28.2 150.4,28.2 R1004.1
N$13
  Top 0.2: R1007.1 R1005.2 148,24.6 150.4,24.6 R1006.1
PP3V0  (via drill 0.2)
  Top 0.2: 50.6,19 59,10.6 | 59,10.6 59.8,9.8 59.8,7.6 R1013.2 | 50.6,19 50.6,21.4 R1019.2 50.4,21.6 50.4,22.4 49.8,23 49.8,29.6 50.2,30 50.2,32.4 C1008.1 | 22,13.4 22,21.4 R1025.2 22,21.6 22,22.4 23,23.4 23,25 U1002.14 | 22,13.4 22,7.6 R1026.2 | 31.6,19 40,10.6 | 40,10.6 40.8,9.8 40.8,7.6 R1012.2 | 31.6,19 31.6,21.4 R1023.2 | 22,13.4 26,13.4 31.6,19 | 50.6,19 48.8,19 41.8,12 41.4,12 40,10.6 | 159.8,31 159.8,31.6 IC1001.8 159.8,31 | 159.8,31 160.6,30.2 161.2,30.2 162.2,31.2 | 162.2,31.2 162.2,31.6 IC1001.6 162.2,31.2 | 164.8,30.2 164.8,31.6 IC1001.4 | 164.8,30.2 164.8,22.4 IC1001.15 | 162.2,31.2 163.2,30.2 164.8,30.2 | J1001.11 162.6,3 158.2,7.4 155,7.4 R1018.2 154.8,7.6 154.8,9.8 149.4,15.2 149.4,18.6 | 149.4,18.6 148.2,18.6 146.4,20.4 | 149.4,18.6 153,18.6 R1024.2 | 146.4,20.4 145.4,21.4 C1002.1 | 153,27 153,29.4 R1010.1 | C1001.1 145.4,32.4 151.4,32.4 152,31.8 152,31 153,30 153,29.6 R1010.1 | v146.6,20.6 146.4,20.4 | 153,27 v152,26 | 153,27 R1011.2 | 159.8,31 159,30.2 156.2,30.2 155.8,30.6 154.2,30.6 153.2,29.6 R1010.1 | J1002.3 80.6,3 79,4.6 79,7.4 R1014.2 79,7.6 80.2,7.6 90,17.4 | 90,17.4 88,19.4 88,21.4 C1007.1 87.8,21.6 86.6,22.8 84.6,22.8 83.4,24 79.8,24 U1001.16 79.6,24 79.6,23 79,22.4 79,21.6 C1004.1 78.8,21.6 77.6,22.8 76.2,22.8 75,21.6 74.4,21.6 C1010.1 74.2,21.6 74.2,21.8 72,24 70.8,24 U1003.16 70.6,24 70.6,23.6 70,23 70,21.6 R1020.2 69.8,21.4 59,10.6 | 90,17.4 97,10.4 | 97,10.4 97.8,9.6 97.8,7.6 R1015.2 | C1005.1 107.2,32.4 107.2,31.6 106.8,31.2 106.8,29.2 107.4,28.6 107.4,21.6 R1021.2 107.6,21.4 107.6,19 | 107.6,19 116,10.6 | 116,10.6 116.8,9.8 116.8,7.6 R1016.2 | C1003.1 126.2,32.4 126.2,31.6 125.8,31.2 125.8,29.2 126.4,28.6 126.4,21.6 R1022.2 126.6,21.4 126.6,19
  Top 0.2: 126.6,19 v135.8,9.8 135.8,7.6 R1017.2 | 116,10.6 119.4,14 121.6,14 126.6,19 | 97,10.4 100.6,14 102.6,14 107.6,19
  Bottom 0.2: v152,26 v146.6,20.6 v135.8,9.8
  pour Top: -0.92,-0.92 175.92,-0.92 175.92,36.92 -0.92,36.92
VOLUME  (via drill 0.2)
  Top 0.2: v157.4,31.8 158.4,31.8 IC1001.9 | v122.8,23 115.4,23 v114,21.6 | v108,15.6 93.8,1.4 79.8,1.4 78.2,3 J1002.2
  Bottom 0.2: v157.4,31.8 154.6,31.8 152.2,34.2 134,34.2 v122.8,23 | v108,15.6 v114,21.6

### Text on the board
tAdjust: synthbadge | aedancullen.com
bAdjust: - | + | 3V VOL GND